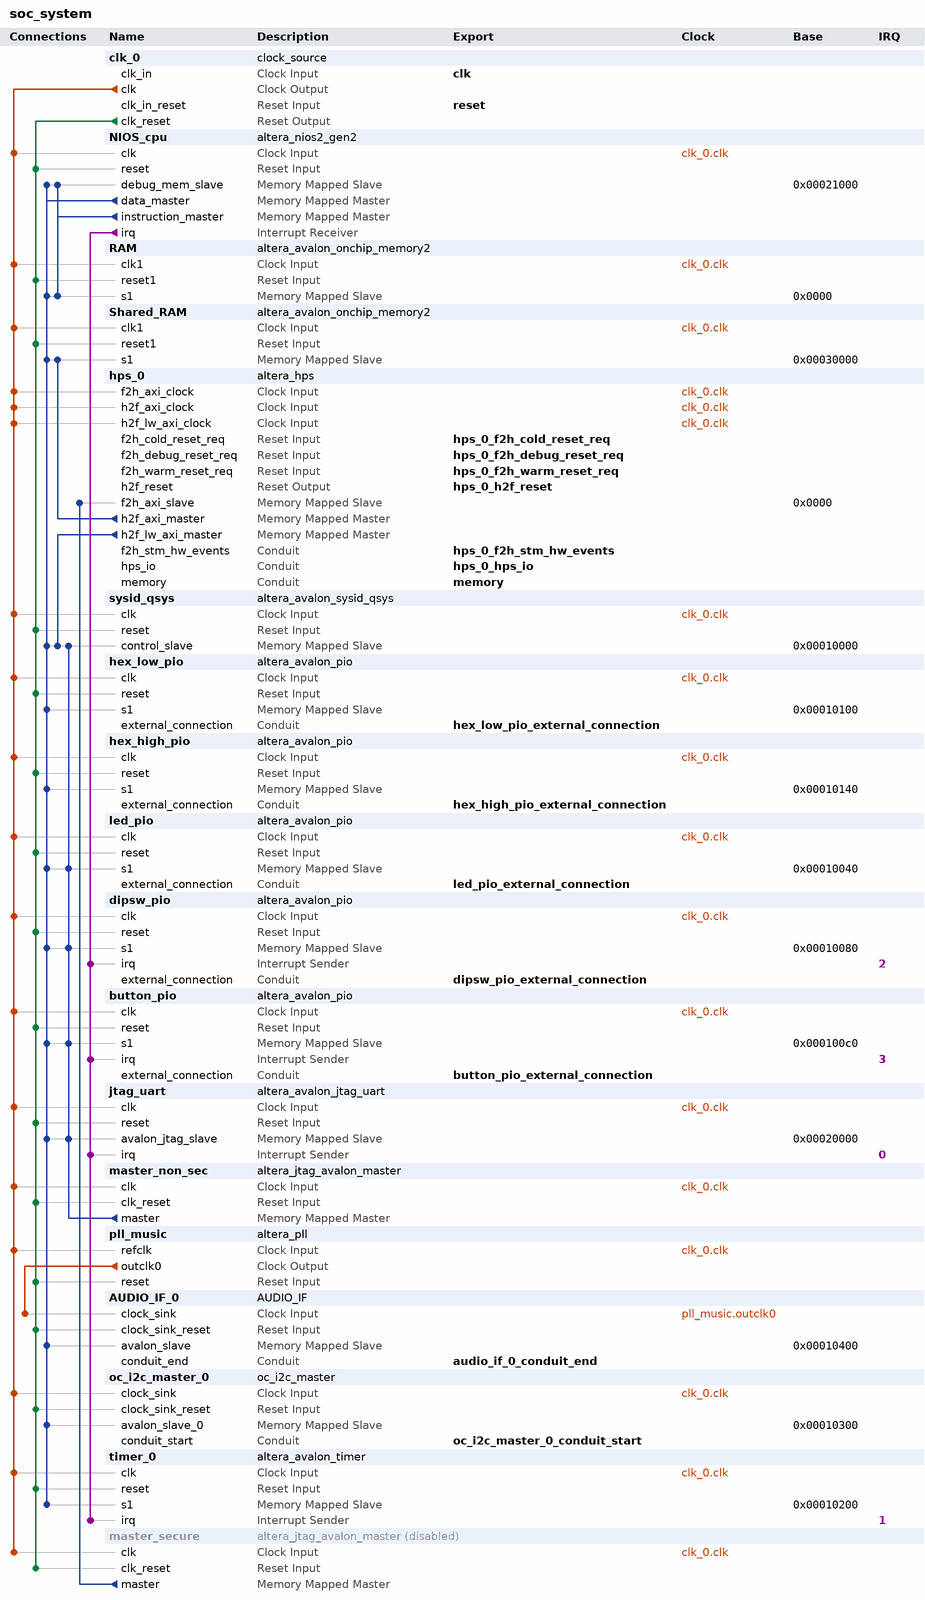
[diagram p0: system contents]
# Platform Designer (Qsys) system soc_system, Cyclone V 5CSEMA5F31C6
# Parameters at their usual value, and those the tool derives, are not listed.
package require -exact qsys 18.1
create_system soc_system
set_project_property DEVICE_FAMILY {Cyclone V}
set_project_property DEVICE 5CSEMA5F31C6

add_instance clk_0 clock_source 18.1
set_instance_parameter_value clk_0 clockFrequency 50000000

add_instance NIOS_cpu altera_nios2_gen2 18.1
set_instance_parameter_value NIOS_cpu dcache_size 2048
set_instance_parameter_value NIOS_cpu exceptionSlave RAM.s1
set_instance_parameter_value NIOS_cpu icache_size 4096
set_instance_parameter_value NIOS_cpu impl Tiny
set_instance_parameter_value NIOS_cpu resetSlave RAM.s1

add_instance RAM altera_avalon_onchip_memory2 18.1
set_instance_parameter_value RAM dataWidth 64
set_instance_parameter_value RAM dualPort false
set_instance_parameter_value RAM initMemContent true
set_instance_parameter_value RAM initializationFileName onchip_memory2_0
set_instance_parameter_value RAM memorySize 65536

add_instance Shared_RAM altera_avalon_onchip_memory2 18.1
set_instance_parameter_value Shared_RAM dataWidth 32
set_instance_parameter_value Shared_RAM dualPort false
set_instance_parameter_value Shared_RAM initMemContent true
set_instance_parameter_value Shared_RAM initializationFileName onchip_mem.hex
set_instance_parameter_value Shared_RAM memorySize 65536

add_instance hps_0 altera_hps 18.1
set_instance_parameter_value hps_0 EMAC1_Mode RGMII
set_instance_parameter_value hps_0 EMAC1_PinMuxing {HPS I/O Set 0}
set_instance_parameter_value hps_0 F2SCLK_COLDRST_Enable true
set_instance_parameter_value hps_0 F2SCLK_DBGRST_Enable true
set_instance_parameter_value hps_0 F2SCLK_WARMRST_Enable true
set_instance_parameter_value hps_0 F2SINTERRUPT_Enable true
set_instance_parameter_value hps_0 F2S_Width 2
set_instance_parameter_value hps_0 FPGA_PERIPHERAL_OUTPUT_CLOCK_FREQ_EMAC0_GTX_CLK 100
set_instance_parameter_value hps_0 FPGA_PERIPHERAL_OUTPUT_CLOCK_FREQ_EMAC0_MD_CLK 100.0
set_instance_parameter_value hps_0 FPGA_PERIPHERAL_OUTPUT_CLOCK_FREQ_EMAC1_GTX_CLK 100
set_instance_parameter_value hps_0 FPGA_PERIPHERAL_OUTPUT_CLOCK_FREQ_EMAC1_MD_CLK 100.0
set_instance_parameter_value hps_0 HPS_PROTOCOL DDR3
set_instance_parameter_value hps_0 I2C0_Mode I2C
set_instance_parameter_value hps_0 I2C0_PinMuxing {HPS I/O Set 0}
set_instance_parameter_value hps_0 I2C1_Mode I2C
set_instance_parameter_value hps_0 I2C1_PinMuxing {HPS I/O Set 0}
set_instance_parameter_value hps_0 LWH2F_Enable true
set_instance_parameter_value hps_0 MEM_BANKADDR_WIDTH 3
set_instance_parameter_value hps_0 MEM_CLK_FREQ 400.0
set_instance_parameter_value hps_0 MEM_COL_ADDR_WIDTH 10
set_instance_parameter_value hps_0 MEM_DQ_WIDTH 32
set_instance_parameter_value hps_0 MEM_DRV_STR RZQ/6
set_instance_parameter_value hps_0 MEM_ROW_ADDR_WIDTH 15
set_instance_parameter_value hps_0 MEM_RTT_NOM RZQ/6
set_instance_parameter_value hps_0 MEM_RTT_WR {Dynamic ODT off}
set_instance_parameter_value hps_0 MEM_TCL 7
set_instance_parameter_value hps_0 MEM_TFAW_NS 45.0
set_instance_parameter_value hps_0 MEM_TRAS_NS 36.0
set_instance_parameter_value hps_0 MEM_TRCD_NS 13.125
set_instance_parameter_value hps_0 MEM_TRFC_NS 300.0
set_instance_parameter_value hps_0 MEM_TRP_NS 13.125
set_instance_parameter_value hps_0 MEM_VENDOR Micron
set_instance_parameter_value hps_0 MEM_WTCL 7
set_instance_parameter_value hps_0 QSPI_Mode {1 SS}
set_instance_parameter_value hps_0 QSPI_PinMuxing {HPS I/O Set 0}
set_instance_parameter_value hps_0 REF_CLK_FREQ 25.0
set_instance_parameter_value hps_0 S2FCLK_USER2CLK 5
set_instance_parameter_value hps_0 S2F_Width 3
set_instance_parameter_value hps_0 SDIO_Mode {4-bit Data}
set_instance_parameter_value hps_0 SDIO_PinMuxing {HPS I/O Set 0}
set_instance_parameter_value hps_0 SPIM1_Mode {Single Slave Select}
set_instance_parameter_value hps_0 SPIM1_PinMuxing {HPS I/O Set 0}
set_instance_parameter_value hps_0 STM_Enable true
set_instance_parameter_value hps_0 TIMING_BOARD_AC_SKEW 0.02
set_instance_parameter_value hps_0 TIMING_BOARD_AC_TO_CK_SKEW 0.01
set_instance_parameter_value hps_0 TIMING_BOARD_DQ_TO_DQS_SKEW 0.05
set_instance_parameter_value hps_0 TIMING_BOARD_MAX_CK_DELAY 0.03
set_instance_parameter_value hps_0 TIMING_BOARD_MAX_DQS_DELAY 0.02
set_instance_parameter_value hps_0 TIMING_BOARD_SKEW_BETWEEN_DQS 0.06
set_instance_parameter_value hps_0 TIMING_BOARD_SKEW_CKDQS_DIMM_MAX 0.12
set_instance_parameter_value hps_0 TIMING_BOARD_SKEW_CKDQS_DIMM_MIN 0.06
set_instance_parameter_value hps_0 TIMING_BOARD_SKEW_WITHIN_DQS 0.01
set_instance_parameter_value hps_0 TIMING_TDH 65
set_instance_parameter_value hps_0 TIMING_TDQSCK 255
set_instance_parameter_value hps_0 TIMING_TDQSQ 125
set_instance_parameter_value hps_0 TIMING_TDS 30
set_instance_parameter_value hps_0 TIMING_TIH 140
set_instance_parameter_value hps_0 TIMING_TIS 190
set_instance_parameter_value hps_0 TIMING_TQSH 0.4
set_instance_parameter_value hps_0 UART0_Mode {No Flow Control}
set_instance_parameter_value hps_0 UART0_PinMuxing {HPS I/O Set 0}
set_instance_parameter_value hps_0 USB1_Mode SDR
set_instance_parameter_value hps_0 USB1_PinMuxing {HPS I/O Set 0}
set_instance_parameter_value hps_0 desired_cfg_clk_mhz 100.0
set_instance_parameter_value hps_0 desired_qspi_clk_mhz 400.0

add_instance sysid_qsys altera_avalon_sysid_qsys 18.1
set_instance_parameter_value sysid_qsys id -1395322110

add_instance hex_low_pio altera_avalon_pio 18.1
set_instance_parameter_value hex_low_pio direction Output
set_instance_parameter_value hex_low_pio width 28

add_instance hex_high_pio altera_avalon_pio 18.1
set_instance_parameter_value hex_high_pio direction Output
set_instance_parameter_value hex_high_pio width 14

add_instance led_pio altera_avalon_pio 18.1
set_instance_parameter_value led_pio direction Output
set_instance_parameter_value led_pio resetValue 15
set_instance_parameter_value led_pio width 10

add_instance dipsw_pio altera_avalon_pio 18.1
set_instance_parameter_value dipsw_pio bitClearingEdgeCapReg true
set_instance_parameter_value dipsw_pio captureEdge true
set_instance_parameter_value dipsw_pio direction Input
set_instance_parameter_value dipsw_pio edgeType ANY
set_instance_parameter_value dipsw_pio generateIRQ true
set_instance_parameter_value dipsw_pio irqType EDGE
set_instance_parameter_value dipsw_pio width 10

add_instance button_pio altera_avalon_pio 18.1
set_instance_parameter_value button_pio bitClearingEdgeCapReg true
set_instance_parameter_value button_pio captureEdge true
set_instance_parameter_value button_pio direction Input
set_instance_parameter_value button_pio edgeType FALLING
set_instance_parameter_value button_pio generateIRQ true
set_instance_parameter_value button_pio irqType EDGE
set_instance_parameter_value button_pio width 4

add_instance jtag_uart altera_avalon_jtag_uart 18.1
set_instance_parameter_value jtag_uart allowMultipleConnections true
set_instance_parameter_value jtag_uart simInteractiveOptions INTERACTIVE_ASCII_OUTPUT

add_instance master_non_sec altera_jtag_avalon_master 18.1

add_instance pll_music altera_pll 18.1
set_instance_parameter_value pll_music gui_device_speed_grade 2
set_instance_parameter_value pll_music gui_number_of_clocks 1
set_instance_parameter_value pll_music gui_operation_mode normal
set_instance_parameter_value pll_music gui_output_clock_frequency0 18.432
set_instance_parameter_value pll_music gui_pll_mode {Fractional-N PLL}
set_instance_parameter_value pll_music gui_reference_clock_frequency 50.0
set_instance_parameter_value pll_music gui_use_locked false

add_instance AUDIO_IF_0 AUDIO_IF 1.0

add_instance oc_i2c_master_0 oc_i2c_master 1.0

add_instance timer_0 altera_avalon_timer 18.1
set_instance_parameter_value timer_0 period 50
set_instance_parameter_value timer_0 periodUnits MSEC
set_instance_parameter_value timer_0 timeoutPulseOutput true

add_instance master_secure altera_jtag_avalon_master 18.1
set_instance_property master_secure ENABLED false

# connections
add_connection clk_0.clk button_pio.clk clock
add_connection clk_0.clk dipsw_pio.clk clock
add_connection clk_0.clk hex_high_pio.clk clock
add_connection clk_0.clk hex_low_pio.clk clock
add_connection clk_0.clk hps_0.f2h_axi_clock clock
add_connection clk_0.clk hps_0.h2f_axi_clock clock
add_connection clk_0.clk hps_0.h2f_lw_axi_clock clock
add_connection clk_0.clk jtag_uart.clk clock
add_connection clk_0.clk led_pio.clk clock
add_connection clk_0.clk master_non_sec.clk clock
add_connection clk_0.clk master_secure.clk clock
add_connection clk_0.clk NIOS_cpu.clk clock
add_connection clk_0.clk oc_i2c_master_0.clock_sink clock
add_connection clk_0.clk pll_music.refclk clock
add_connection clk_0.clk RAM.clk1 clock
add_connection clk_0.clk Shared_RAM.clk1 clock
add_connection clk_0.clk sysid_qsys.clk clock
add_connection clk_0.clk timer_0.clk clock
add_connection pll_music.outclk0 AUDIO_IF_0.clock_sink clock
add_connection clk_0.clk_reset AUDIO_IF_0.clock_sink_reset reset
add_connection clk_0.clk_reset button_pio.reset reset
add_connection clk_0.clk_reset dipsw_pio.reset reset
add_connection clk_0.clk_reset hex_high_pio.reset reset
add_connection clk_0.clk_reset hex_low_pio.reset reset
add_connection clk_0.clk_reset jtag_uart.reset reset
add_connection clk_0.clk_reset led_pio.reset reset
add_connection clk_0.clk_reset master_non_sec.clk_reset reset
add_connection clk_0.clk_reset master_secure.clk_reset reset
add_connection clk_0.clk_reset NIOS_cpu.reset reset
add_connection clk_0.clk_reset oc_i2c_master_0.clock_sink_reset reset
add_connection clk_0.clk_reset pll_music.reset reset
add_connection clk_0.clk_reset RAM.reset1 reset
add_connection clk_0.clk_reset Shared_RAM.reset1 reset
add_connection clk_0.clk_reset sysid_qsys.reset reset
add_connection clk_0.clk_reset timer_0.reset reset
add_connection hps_0.h2f_axi_master Shared_RAM.s1 avalon
set_connection_parameter_value hps_0.h2f_axi_master/Shared_RAM.s1 baseAddress 0x00030000
add_connection hps_0.h2f_lw_axi_master sysid_qsys.control_slave avalon
set_connection_parameter_value hps_0.h2f_lw_axi_master/sysid_qsys.control_slave baseAddress 0x00010000
add_connection master_non_sec.master button_pio.s1 avalon
set_connection_parameter_value master_non_sec.master/button_pio.s1 baseAddress 0x000100c0
add_connection master_non_sec.master dipsw_pio.s1 avalon
set_connection_parameter_value master_non_sec.master/dipsw_pio.s1 baseAddress 0x00010080
add_connection master_non_sec.master jtag_uart.avalon_jtag_slave avalon
set_connection_parameter_value master_non_sec.master/jtag_uart.avalon_jtag_slave baseAddress 0x00020000
add_connection master_non_sec.master led_pio.s1 avalon
set_connection_parameter_value master_non_sec.master/led_pio.s1 baseAddress 0x00010040
add_connection master_non_sec.master sysid_qsys.control_slave avalon
set_connection_parameter_value master_non_sec.master/sysid_qsys.control_slave baseAddress 0x00010000
add_connection master_secure.master hps_0.f2h_axi_slave avalon
set_connection_parameter_value master_secure.master/hps_0.f2h_axi_slave baseAddress 0x0000
add_connection NIOS_cpu.data_master AUDIO_IF_0.avalon_slave avalon
set_connection_parameter_value NIOS_cpu.data_master/AUDIO_IF_0.avalon_slave baseAddress 0x00010400
add_connection NIOS_cpu.data_master button_pio.s1 avalon
set_connection_parameter_value NIOS_cpu.data_master/button_pio.s1 baseAddress 0x000100c0
add_connection NIOS_cpu.data_master dipsw_pio.s1 avalon
set_connection_parameter_value NIOS_cpu.data_master/dipsw_pio.s1 baseAddress 0x00010080
add_connection NIOS_cpu.data_master hex_high_pio.s1 avalon
set_connection_parameter_value NIOS_cpu.data_master/hex_high_pio.s1 baseAddress 0x00010140
add_connection NIOS_cpu.data_master hex_low_pio.s1 avalon
set_connection_parameter_value NIOS_cpu.data_master/hex_low_pio.s1 baseAddress 0x00010100
add_connection NIOS_cpu.data_master jtag_uart.avalon_jtag_slave avalon
set_connection_parameter_value NIOS_cpu.data_master/jtag_uart.avalon_jtag_slave baseAddress 0x00020000
add_connection NIOS_cpu.data_master led_pio.s1 avalon
set_connection_parameter_value NIOS_cpu.data_master/led_pio.s1 baseAddress 0x00010040
add_connection NIOS_cpu.data_master NIOS_cpu.debug_mem_slave avalon
set_connection_parameter_value NIOS_cpu.data_master/NIOS_cpu.debug_mem_slave baseAddress 0x00021000
add_connection NIOS_cpu.data_master oc_i2c_master_0.avalon_slave_0 avalon
set_connection_parameter_value NIOS_cpu.data_master/oc_i2c_master_0.avalon_slave_0 baseAddress 0x00010300
add_connection NIOS_cpu.data_master RAM.s1 avalon
set_connection_parameter_value NIOS_cpu.data_master/RAM.s1 baseAddress 0x0000
add_connection NIOS_cpu.data_master Shared_RAM.s1 avalon
set_connection_parameter_value NIOS_cpu.data_master/Shared_RAM.s1 baseAddress 0x00030000
add_connection NIOS_cpu.data_master sysid_qsys.control_slave avalon
set_connection_parameter_value NIOS_cpu.data_master/sysid_qsys.control_slave baseAddress 0x00010000
add_connection NIOS_cpu.data_master timer_0.s1 avalon
set_connection_parameter_value NIOS_cpu.data_master/timer_0.s1 baseAddress 0x00010200
add_connection NIOS_cpu.instruction_master NIOS_cpu.debug_mem_slave avalon
set_connection_parameter_value NIOS_cpu.instruction_master/NIOS_cpu.debug_mem_slave baseAddress 0x00021000
add_connection NIOS_cpu.instruction_master RAM.s1 avalon
set_connection_parameter_value NIOS_cpu.instruction_master/RAM.s1 baseAddress 0x0000
add_connection NIOS_cpu.irq button_pio.irq interrupt
set_connection_parameter_value NIOS_cpu.irq/button_pio.irq irqNumber 3
add_connection NIOS_cpu.irq dipsw_pio.irq interrupt
set_connection_parameter_value NIOS_cpu.irq/dipsw_pio.irq irqNumber 2
add_connection NIOS_cpu.irq jtag_uart.irq interrupt
set_connection_parameter_value NIOS_cpu.irq/jtag_uart.irq irqNumber 0
add_connection NIOS_cpu.irq timer_0.irq interrupt
set_connection_parameter_value NIOS_cpu.irq/timer_0.irq irqNumber 1

# exported interfaces
add_interface audio_if_0_conduit_end conduit end
set_interface_property audio_if_0_conduit_end EXPORT_OF AUDIO_IF_0.conduit_end
add_interface button_pio_external_connection conduit end
set_interface_property button_pio_external_connection EXPORT_OF button_pio.external_connection
add_interface clk clock sink
set_interface_property clk EXPORT_OF clk_0.clk_in
add_interface dipsw_pio_external_connection conduit end
set_interface_property dipsw_pio_external_connection EXPORT_OF dipsw_pio.external_connection
add_interface hex_high_pio_external_connection conduit end
set_interface_property hex_high_pio_external_connection EXPORT_OF hex_high_pio.external_connection
add_interface hex_low_pio_external_connection conduit end
set_interface_property hex_low_pio_external_connection EXPORT_OF hex_low_pio.external_connection
add_interface hps_0_f2h_cold_reset_req reset sink
set_interface_property hps_0_f2h_cold_reset_req EXPORT_OF hps_0.f2h_cold_reset_req
add_interface hps_0_f2h_debug_reset_req reset sink
set_interface_property hps_0_f2h_debug_reset_req EXPORT_OF hps_0.f2h_debug_reset_req
add_interface hps_0_f2h_stm_hw_events conduit end
set_interface_property hps_0_f2h_stm_hw_events EXPORT_OF hps_0.f2h_stm_hw_events
add_interface hps_0_f2h_warm_reset_req reset sink
set_interface_property hps_0_f2h_warm_reset_req EXPORT_OF hps_0.f2h_warm_reset_req
add_interface hps_0_h2f_reset reset source
set_interface_property hps_0_h2f_reset EXPORT_OF hps_0.h2f_reset
add_interface hps_0_hps_io conduit end
set_interface_property hps_0_hps_io EXPORT_OF hps_0.hps_io
add_interface led_pio_external_connection conduit end
set_interface_property led_pio_external_connection EXPORT_OF led_pio.external_connection
add_interface memory conduit end
set_interface_property memory EXPORT_OF hps_0.memory
add_interface oc_i2c_master_0_conduit_start conduit end
set_interface_property oc_i2c_master_0_conduit_start EXPORT_OF oc_i2c_master_0.conduit_start
add_interface reset reset sink
set_interface_property reset EXPORT_OF clk_0.clk_in_reset

set_interconnect_requirement {$system} qsys_mm.clockCrossingAdapter HANDSHAKE
set_interconnect_requirement {$system} qsys_mm.maxAdditionalLatency 1

save_system soc_system.qsys
